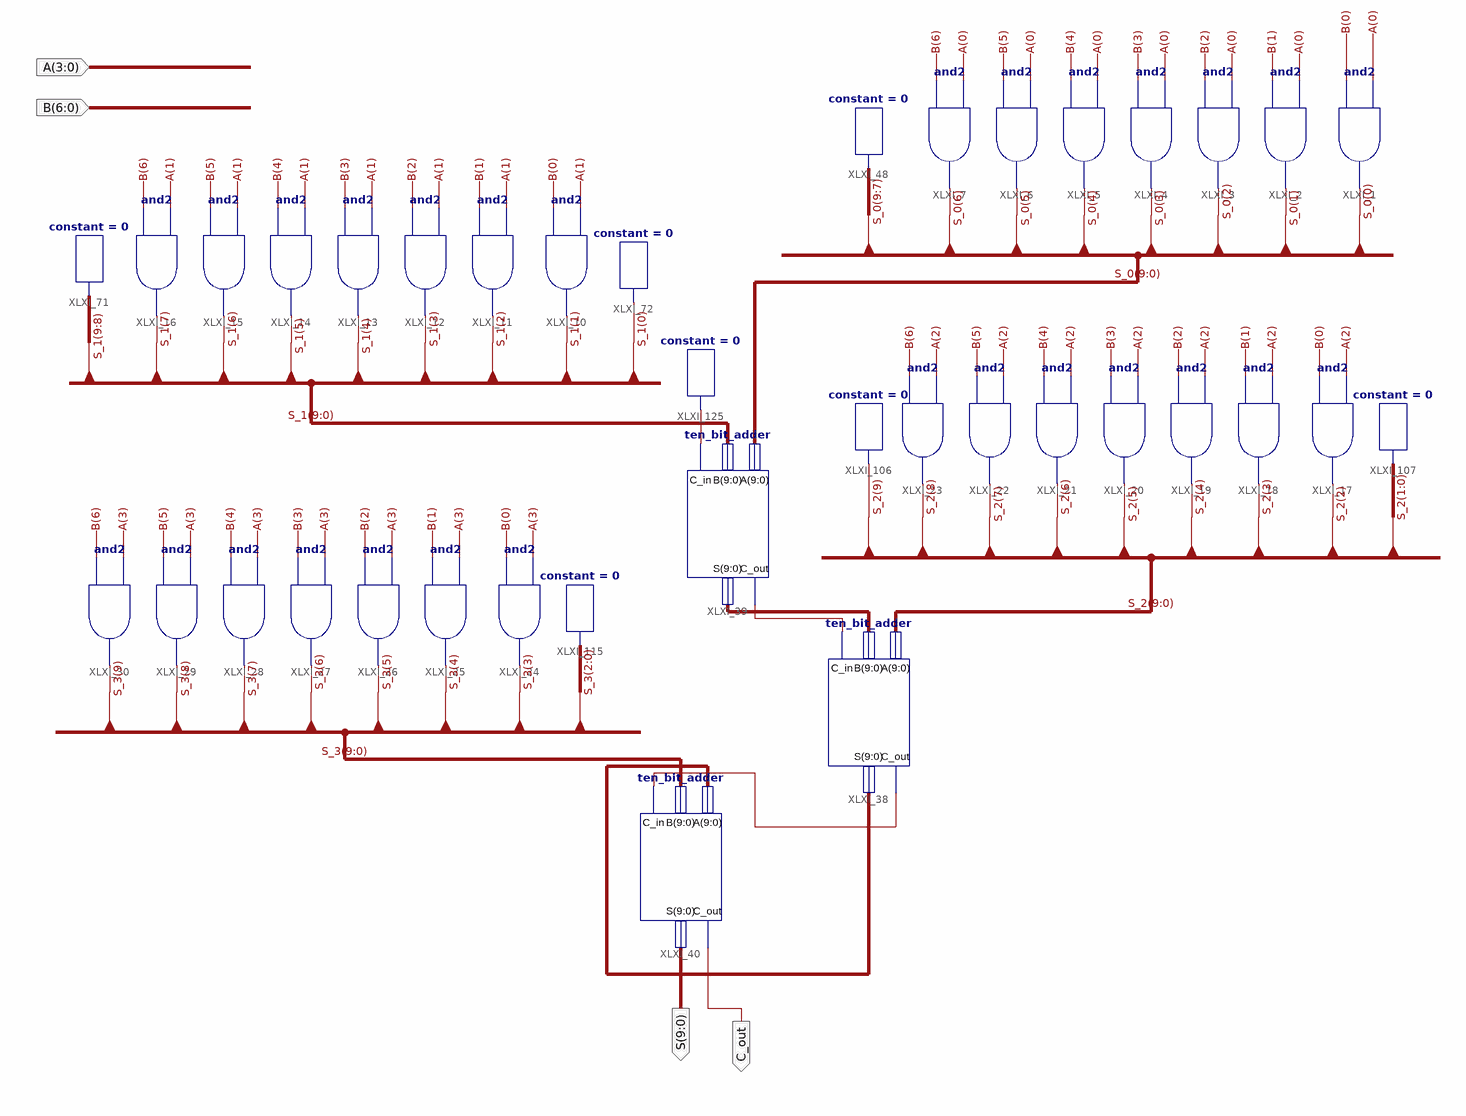
[diagram p0: schematic sheet 1]
// Xilinx ISE schematic binary_multiplier.sch (artix7) as structural Verilog: 38 symbols, 4 ports
module binary_multiplier (
  input  [3:0] A,
  input  [6:0] B,
  output [9:0] S,
  output C_out
);

  wire XLXN_265, XLXN_268, XLXN_272;
  wire [9:0] S_0, S_1, S_2, S_3, XLXN_266, XLXN_267;

  and XLXI_4 (S_0[3], B[3], A[0]);
  and XLXI_5 (S_0[4], B[4], A[0]);
  and XLXI_6 (S_0[5], B[5], A[0]);
  and XLXI_7 (S_0[6], B[6], A[0]);
  and XLXI_3 (S_0[2], B[2], A[0]);
  and XLXI_2 (S_0[1], B[1], A[0]);
  and XLXI_1 (S_0[0], B[0], A[0]);
  constant #(.CValue("0")) XLXI_48 (.O(S_0[9:7]));
  and XLXI_12 (S_1[3], B[2], A[1]);
  and XLXI_13 (S_1[4], B[3], A[1]);
  and XLXI_14 (S_1[5], B[4], A[1]);
  and XLXI_15 (S_1[6], B[5], A[1]);
  and XLXI_16 (S_1[7], B[6], A[1]);
  and XLXI_11 (S_1[2], B[1], A[1]);
  and XLXI_10 (S_1[1], B[0], A[1]);
  constant #(.CValue("0")) XLXI_71 (.O(S_1[9:8]));
  constant #(.CValue("0")) XLXI_72 (.O(S_1[0]));
  ten_bit_adder XLXI_39 (.A(S_0), .B(S_1), .C_in(XLXN_272), .C_out(XLXN_265), .S(XLXN_266));
  ten_bit_adder XLXI_40 (.A(XLXN_267), .B(S_3), .C_in(XLXN_268), .C_out(C_out), .S(S));
  ten_bit_adder XLXI_38 (.A(S_2), .B(XLXN_266), .C_in(XLXN_265), .C_out(XLXN_268), .S(XLXN_267));
  and XLXI_24 (S_3[3], B[0], A[3]);
  and XLXI_25 (S_3[4], B[1], A[3]);
  and XLXI_26 (S_3[5], B[2], A[3]);
  and XLXI_27 (S_3[6], B[3], A[3]);
  and XLXI_28 (S_3[7], B[4], A[3]);
  and XLXI_29 (S_3[8], B[5], A[3]);
  and XLXI_30 (S_3[9], B[6], A[3]);
  constant #(.CValue("0")) XLXI_115 (.O(S_3[2:0]));
  and XLXI_18 (S_2[3], B[1], A[2]);
  and XLXI_19 (S_2[4], B[2], A[2]);
  and XLXI_20 (S_2[5], B[3], A[2]);
  and XLXI_21 (S_2[6], B[4], A[2]);
  and XLXI_22 (S_2[7], B[5], A[2]);
  and XLXI_23 (S_2[8], B[6], A[2]);
  and XLXI_17 (S_2[2], B[0], A[2]);
  constant #(.CValue("0")) XLXI_106 (.O(S_2[9]));
  constant #(.CValue("0")) XLXI_107 (.O(S_2[1:0]));
  constant #(.CValue("0")) XLXI_125 (.O(XLXN_272));
endmodule
